# EAGLE design FridgeWarninig_Production (EAGLE 7.6.0)
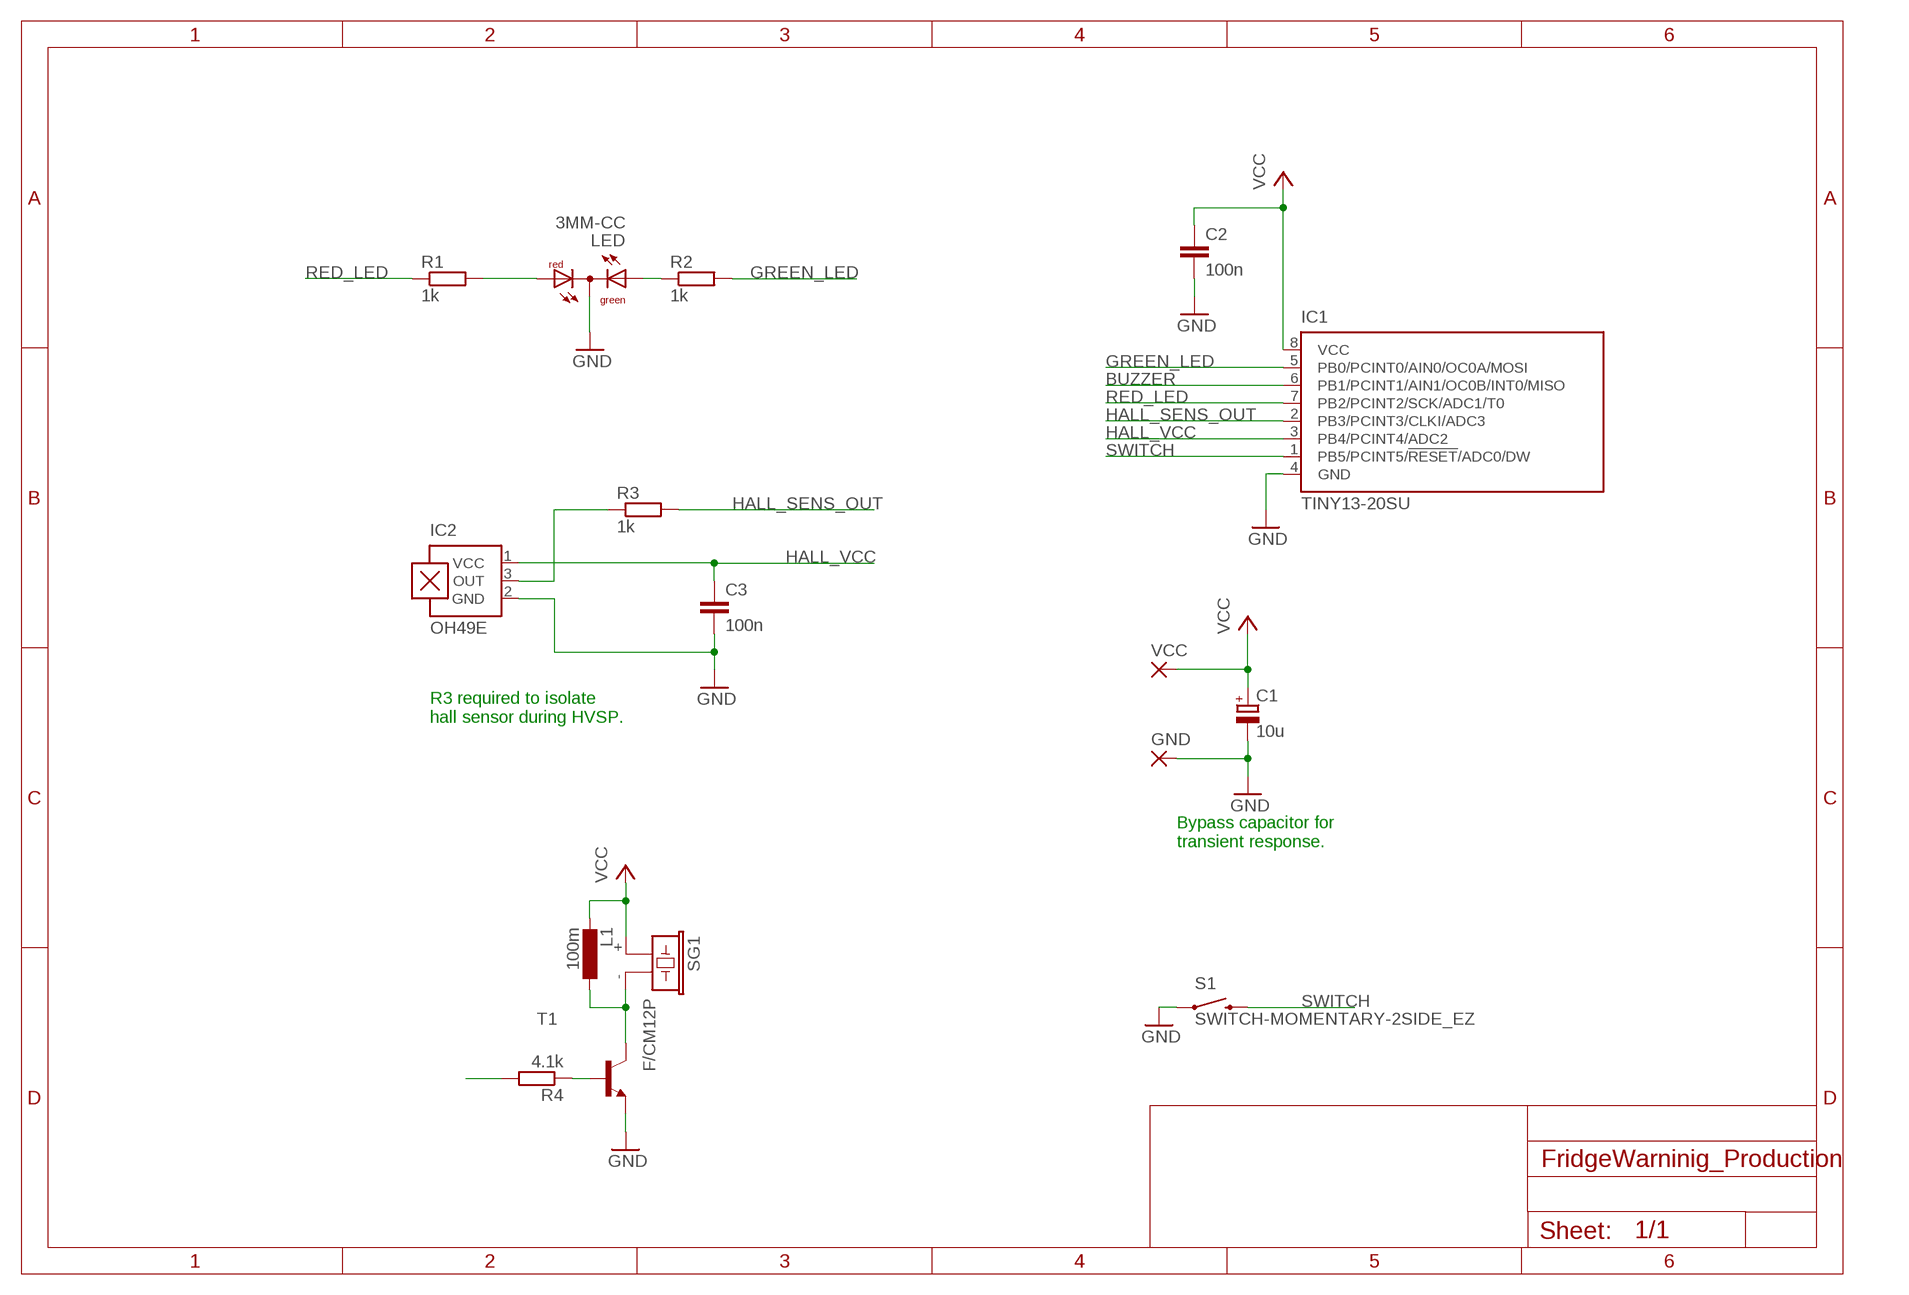
[diagram p0: schematic, sheet 1]

## Parts
C1  10u  CPOL-EU153CLV-0405  [153CLV-0405]
C2  100n  C-EUC0603  [C0603]
C3  100n  C-EUC0603  [C0603]
GND  2,54/1,0  [2,54/1,0]
IC1  TINY13-20SU  [8S2]
IC2  OH49E  A1302UA  [SIP3-UA]
L1  100m  RADIAL_INDUCTOR_9_12L  [TT5D9L]
LED  3MM-CC  [DUOLED-A-3MM]
R1  1k  R-EU_R0603  [R0603]
R2  1k  R-EU_R0603  [R0603]
R3  1k  R-EU_R0603  [R0603]
R4  4.1k  R-EU_R0603  [R0603]
S1  SWITCH-MOMENTARY-2SIDE_EZ  [TACTILE-PTH-SIDEEZ]
SG1  F/CM12P  [F/CM12P]
T1  MMBT918LT1-NPN-SOT23-BEC  [SOT23-BEC]
VCC  2,54/1,0  [2,54/1,0]

## Nets
BUZZER: IC1.6(PB1/PCINT1/AIN1/OC0B/INT0/MISO) R4.2
GND: C1.- C2.2 C3.2 GND.1(P) IC1.4(GND) IC2.2(GND) LED.2(C) S1.1 T1.E
GREEN_LED: IC1.5(PB0/PCINT0/AIN0/OC0A/MOSI) R2.2
HALL_SENS_OUT: IC1.2(PB3/PCINT3/CLKI/ADC3) R3.2
HALL_VCC: C3.1 IC1.3(PB4/PCINT4/ADC2) IC2.1(VCC)
N$2: R4.1 T1.B
N$4: L1.+ SG1.- T1.C
N$5: IC2.3(OUT) R3.1
N$7: LED.1(AG) R2.1
N$8: LED.3(AR) R1.2
RED_LED: IC1.7(PB2/PCINT2/SCK/ADC1/T0) R1.1
SWITCH: IC1.1(PB5/PCINT5/!RESET!/ADC0/DW) S1.2
VCC: C1.+ C2.1 IC1.8(VCC) L1.- SG1.+ VCC.1(P)

## Notes on the sheet
- R3 required to isolate 
  hall sensor during HVSP.
- Bypass capacitor for 
  transient response.

## Library data of the parts
C1 = rcl:CPOL-EU: POLARIZED CAPACITOR, European symbol
C2 C3 = resistor:C-EU: CAPACITOR, European symbol
GND VCC = wirepad:2,54/1,0: THROUGH-HOLE PAD
IC1 = atmel:TINY13: 8-bit AVR Microcontroller with 1K Bytes In-System Programmable Flash Source: http://www.atmel.com/dyn/resources/prod_documents/2535S.pdf; MPN: ATTINY13-20SU; OC_FARNELL: 9171568; OC_NEWARK: 96K6522
IC2 = dea:A13*?: Linear Hall Effect Sensor ICs Continuous-Time Ratiometric High-Temperature Operation Programmable Linear with Analog Output A1302 -Replacement- UGN3503 Source: http://www.allegromicro.com/en/Products/Part_Numbers/1301/1301.pdf http://www.allegromicro.com/en/Products/Part_Numbers/1321/1321.pdf http://www.allegromicro.com/en/Products/Part_Numbers/1381/1381.pdf; MF: ALLEGRO MICROSYSTEMS, INC.; MPN: A1302EUA-T; OC_FARNELL: 1521708; OC_NEWARK: 31K6639
L1 = dea:RADIAL_INDUCTOR_9_12L
LED = led:3MM-CC
R1-R4 = resistor:R-EU_: RESISTOR, European symbol
S1 = dea:SWITCH-MOMENTARY-2: Various NO switches- pushbuttons, reed, etc
SG1 = buzzer:F/CM12P: BUZZER Source: Buerklin; OC_FARNELL: unknown; OC_NEWARK: unknown
T1 = transistor:*-NPN-: NPN Transistror BF959 corrected 2008.03.06

## Board
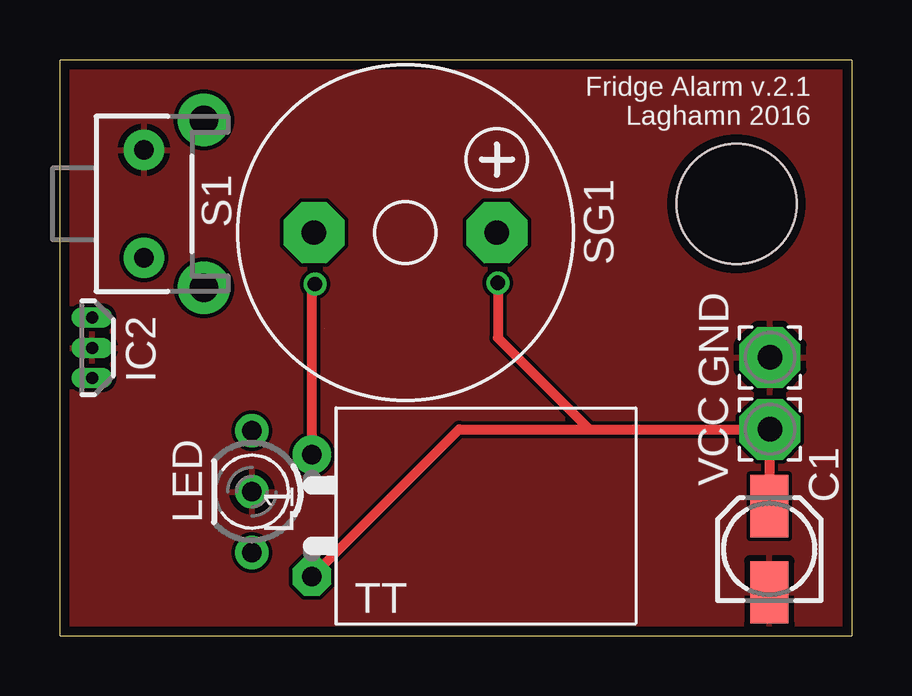
[diagram p1: board, top side]
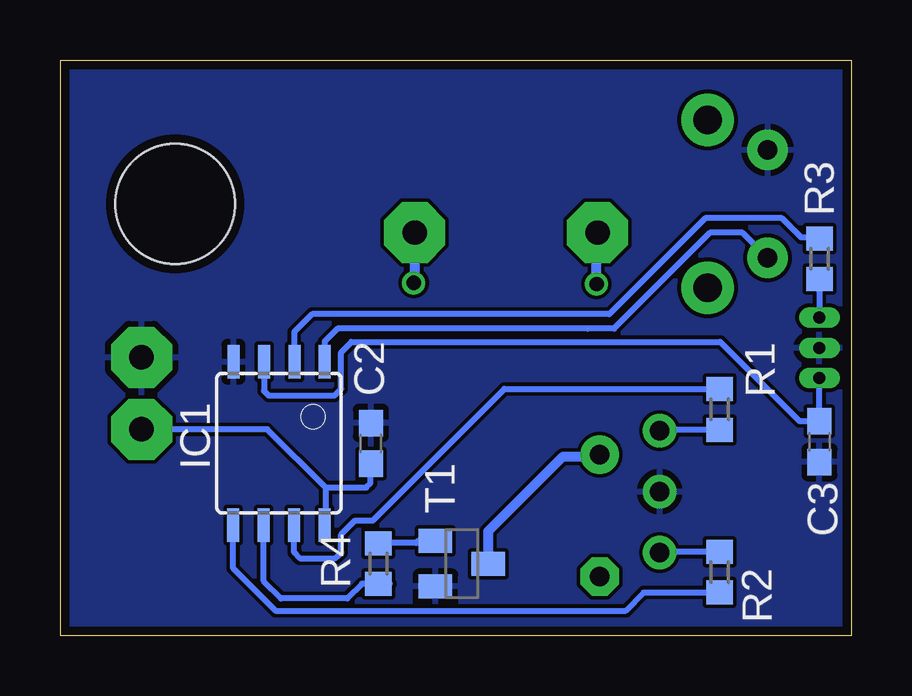
[diagram p2: board, bottom side, seen from below]

Size 33 x 24 mm. Coordinates in mm from the lower left corner, seen from the top.
Outline: 0,0 33,0 33,24 0,24 0,0
Copper layers (1*16): Top 0.0356mm / dielectric 1.5011mm / Bottom 0.0356mm
Design rules "oshpark-2layer (1)": minimum track width 6mil, minimum drill 13mil, track to track 6mil, track to pad 6mil, pad to pad 6mil, via to via 6mil, smd to smd 6mil, copper to edge 15mil, drill to drill 6mil, minimum pad ring 7mil, minimum via ring 7mil, stop-mask expansion 2.5mil, vias tented up to drill 0mil, thermal gap 10mil
Holes 5 mm at 28.2,18
tKeepout: area 23.2,13 to 33.2,23

### Footprints (pad centres in the part's own frame; a part is rotated, then mirrored left to right if it is on the bottom)
153CLV-0405 = smd 2.6 x 1.6: + 1.8,0; - -1.8,0
C0603 = smd 1.1 x 1: 1 -0.85,0; 2 0.85,0
2,54/1,0 = drill 1.016 pad 2.54 octagon: 1 0,0
8S2 = smd 0.5 x 1.4: 1 -1.905,-3.404; 2 -0.645,-3.404; 3 0.625,-3.404; 4 1.895,-3.404; 5 1.905,3.404; 6 0.635,3.404; 7 -0.635,3.404; 8 -1.905,3.404
SIP3-UA = drill 0.5 pad 0.7 long: 1 -1.27,0; 2 0,0; 3 1.27,0
TT5D9L = drill 0.813 pad 1.6: + -2.54,0 | drill 0.813 pad 1.6 octagon: - 2.54,0
DUOLED-A-3MM = drill 0.8 pad 1.4: 1 -2.54,0; 2 0,0; 3 2.54,0
R0603 = smd 1 x 1.1: 1 -0.85,0; 2 0.85,0
TACTILE-PTH-SIDEEZ = drill 0.8 pad 1.7: 1 -2.25,0; 2 2.25,0 | drill 1.2 pad 2.2: ANCHOR1 -3.5,2.5; ANCHOR2 3.5,2.5
F/CM12P = drill 1.016 pad 2.54 octagon: + 3.81,0; - -3.81,0
SOT23-BEC = smd 1 x 1.4: B -0.95,-1.1; C 0,1.1; E 0.95,-1.1

### Placement (x,y rotation side)
C1  29.57,3.6 90 top
C2  20.03,8.01 90 bottom
C3  1.33,8.08 270 bottom
GND  29.6,11.6 0 top
IC1  23.87,8.01 180 bottom
IC2  1.33,12 90 top
L1  10.5,5 270 top
LED  8,6 90 top
R1  5.5,9.43 270 bottom
R2  5.5,2.65 270 bottom
R3  1.33,15.71 90 bottom
R4  19.72,3 270 bottom
S1  3.5,18 270 top
SG1  14.4,16.8 0 top
T1  16.25,3 270 bottom
VCC  29.6,8.6 0 top

### Tracks (layer width: path | path; a pad name or v marks a point on that pad's centre or on a via)
BUZZER
  Bottom 0.254: IC1.6 24.5,4.6 24.5,2.26 23.79,1.55 21.02,1.55 20.41,2.16 19.83,2.16 R4.2 19.24,2.16
GND
  pour Bottom: 0,0 0,24 33,24 33,0
  pour Top: 0,0 0,24 33,24 33,0
GREEN_LED
  Bottom 0.254: IC1.5 25.77,2.79 24.02,1.04 9.41,1.04 8.66,1.8 R2.2
HALL_SENS_OUT
  Bottom 0.254: R3.2 1.1,16.6 2.1,16.6 2.9,17.4 6.1,17.4 10.1,13.4 22.48,13.4 23.23,12.65 IC1.2
HALL_VCC
  Bottom 0.254: IC1.3 24.5,10.21 24.3,10.01 21.55,10.01 21.28,10.29 21.28,11.81 20.84,12.24 5.48,12.24 2.17,8.94 1.33,8.94 | 1.33,8.94 C3.1 1.23,8.93 | 1.33,8.94 IC2.1
N$2
  Bottom 0.254: 17.45,3.85 T1.B 17.52,3.96 18.05,3.96 18.15,3.86 19.7,3.86 R4.1
N$4  (via drill 0.6)
  Top 0.406: L1.+ 10.5,14.52 v10.63,14.66
  Bottom 0.406: v10.63,14.66 10.63,16.76 SG1.- | L1.+ 10.57,7.47 12.03,7.47 15.15,4.35 T1.C
N$5
  Bottom 0.254: 1.23,14.86 R3.1 IC2.3
N$7
  Bottom 0.254: R2.1 8,3.5
  Bottom 0.406: 8,3.5 LED.1
N$8
  Bottom 0.254: R1.2 8,8.58
  Bottom 0.406: 8,8.58 LED.3
RED_LED
  Bottom 0.254: IC1.7 23.24,3.46 23,3.23 21.53,3.23 21.43,3.3 21.28,3.45 21.28,4.22 20.69,4.8 19.95,4.8 14.47,10.28 R1.1
SWITCH  (1 unrouted)
  Bottom 0.254: S1.2 4.55,16.8 5.9,16.8 9.9,12.8 11,12.8 21.43,12.8 21.96,12.27 IC1.1
VCC  (via drill 0.6)
  Top 0.406: VCC.1 | VCC.1 29.57,8.6 C1.+ | L1.- 16.64,8.6 22.06,8.6 | 22.06,8.6 VCC.1 | v18.25,14.71 18.25,12.41 22.06,8.6
  Bottom 0.254: 21.94,6.17 21.94,4.64 IC1.8 | 21.94,6.17 24.36,8.6 VCC.1 | 21.94,6.17 20.23,6.17 20.06,6.35 20.06,7.14 C2.1
  Bottom 0.406: SG1.+ 18.21,14.75 v18.25,14.71

### Text on the board
tPlace: Fridge Alarm v.2.1 / Laghamn 2016